# Altium project STM32_Calculator.PrjPcb
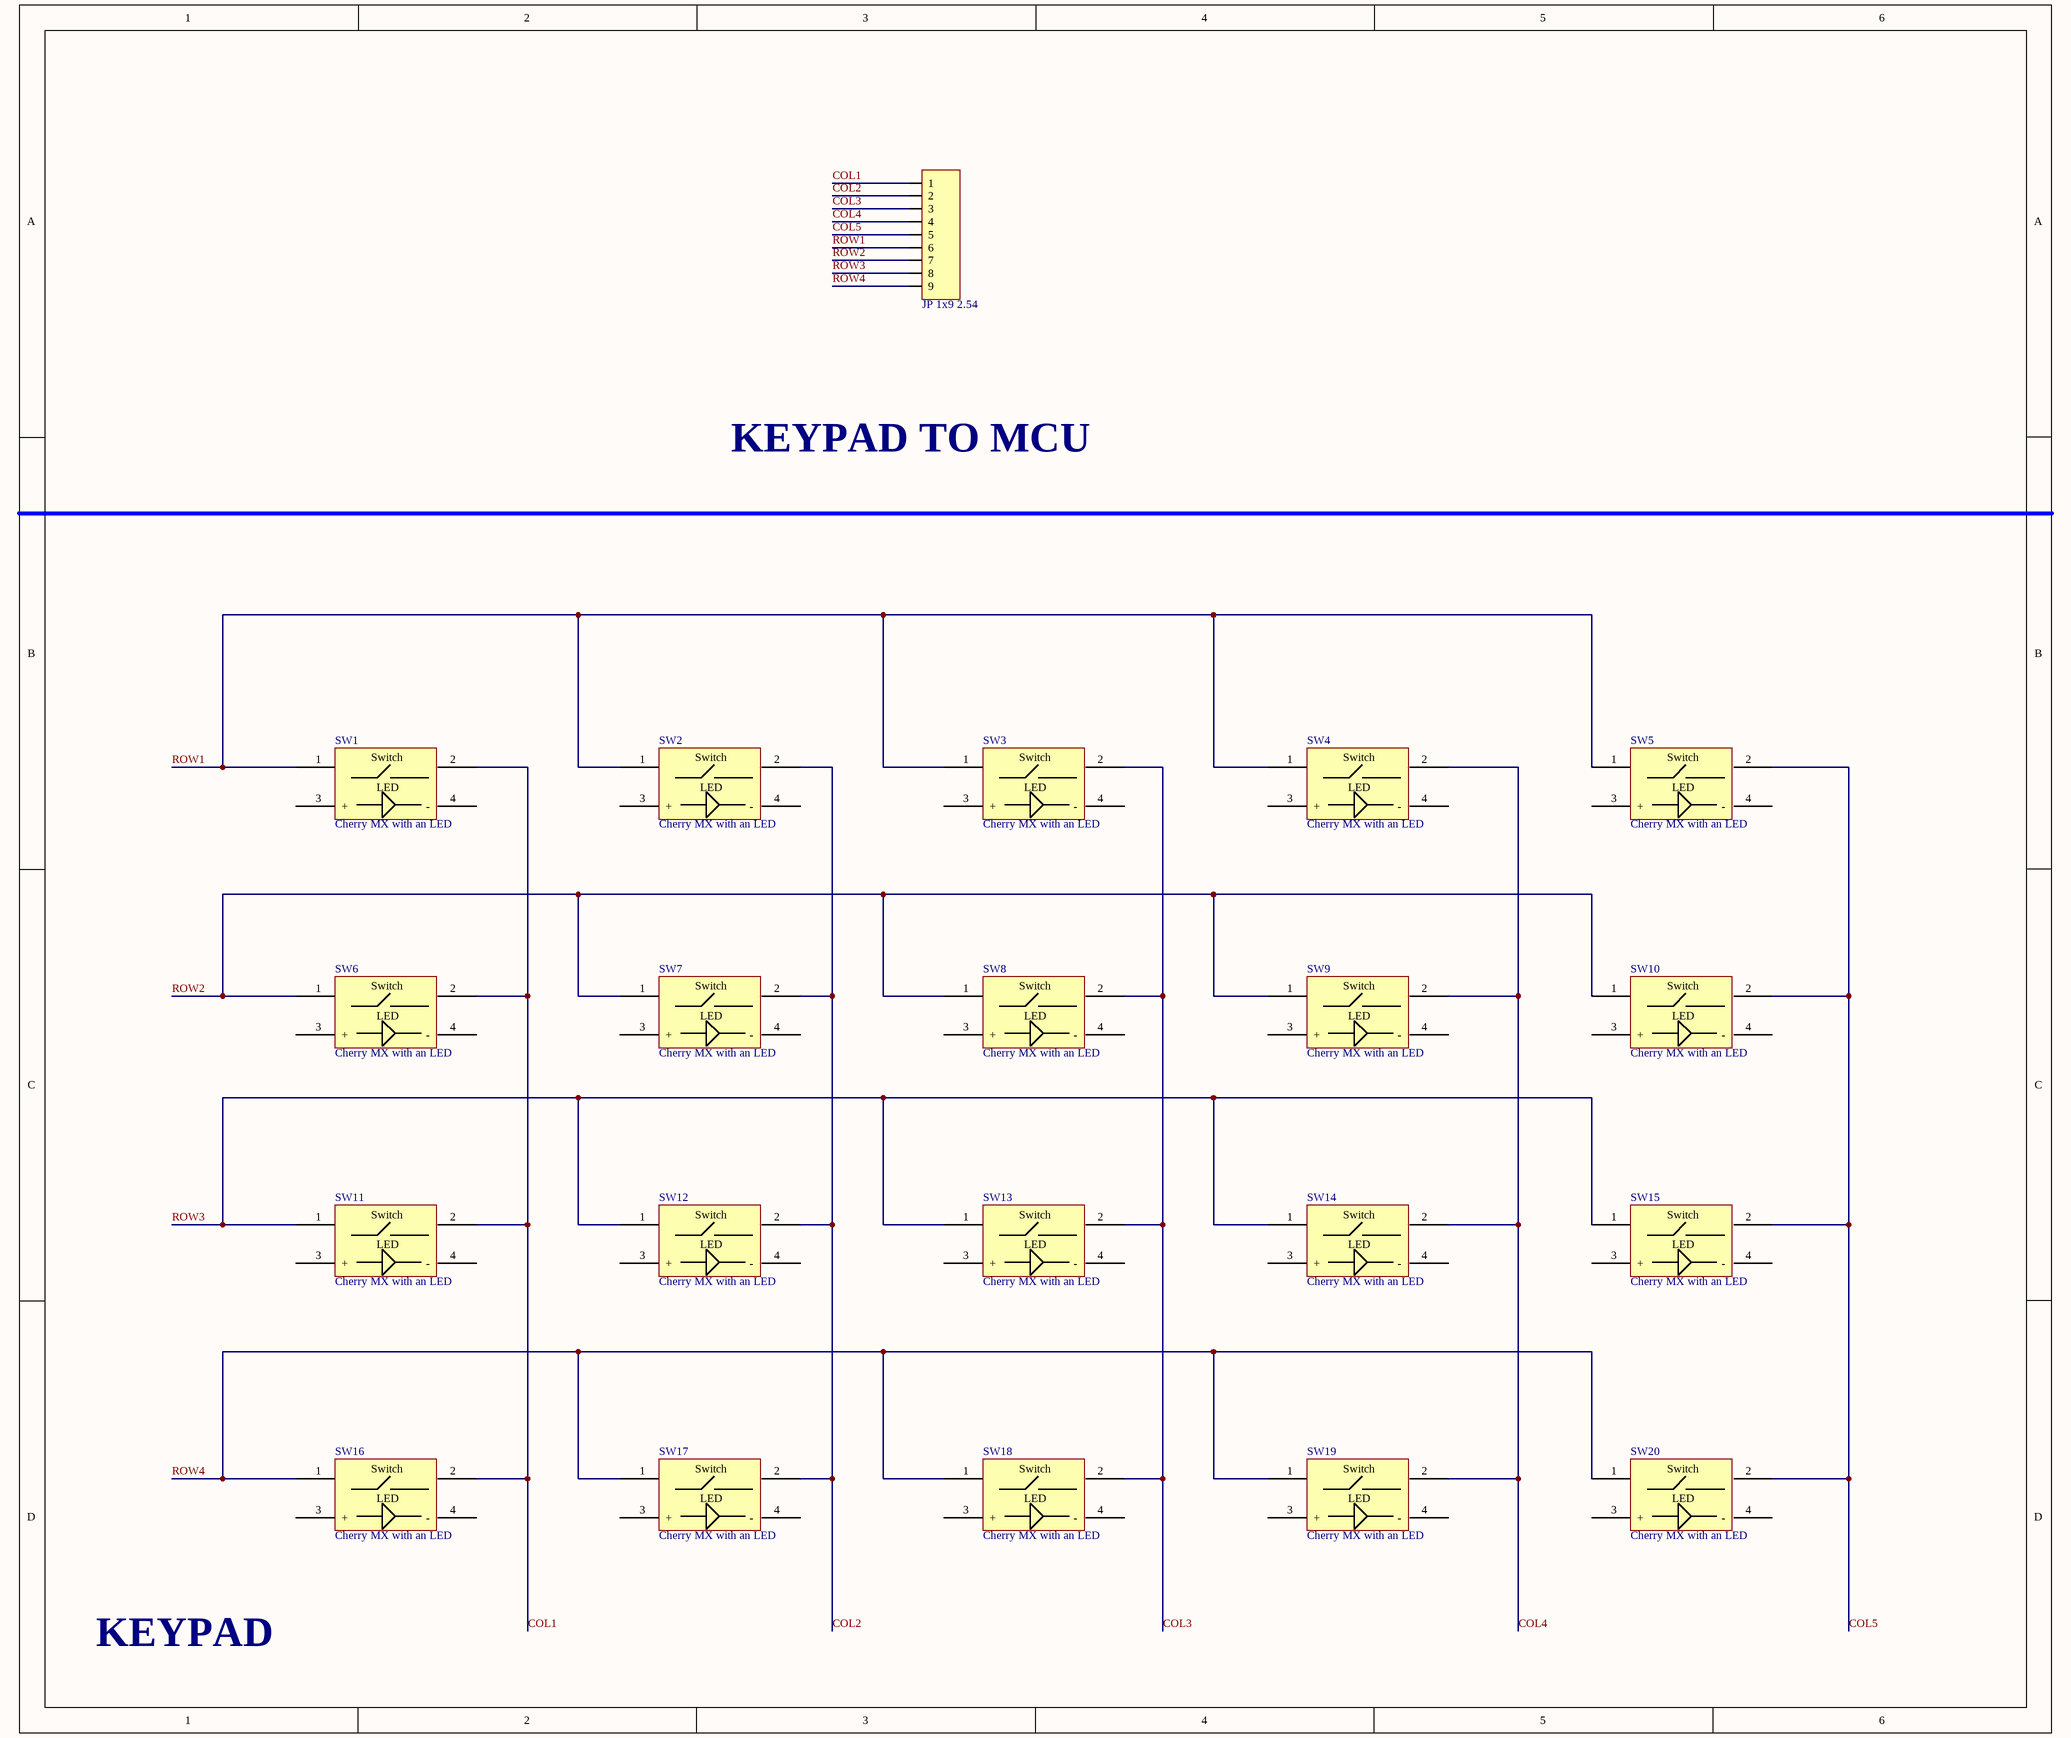
[diagram p0: SCHEMATIC.SchDoc]
1 sheet, 21 parts. Net scope: global (net labels, ports and power ports of the same name join across sheets).
Board files: calculator_pcb.PcbDoc, print_file_Keypad_LCD.PcbDoc

## Sheet SCHEMATIC.SchDoc
size 400 x 340 mm; SheetNumber: 1; SheetTotal: 1

### Parts
JP1  JP 1x9 2.54  [JP 1x9 DC]
SW1  Cherry MX with an LED  [MX_Cherry_LED]
SW2  Cherry MX with an LED  [MX_Cherry_LED]
SW3  Cherry MX with an LED  [MX_Cherry_LED]
SW4  Cherry MX with an LED  [MX_Cherry_LED]
SW5  Cherry MX with an LED  [MX_Cherry_LED]
SW6  Cherry MX with an LED  [MX_Cherry_LED]
SW7  Cherry MX with an LED  [MX_Cherry_LED]
SW8  Cherry MX with an LED  [MX_Cherry_LED]
SW9  Cherry MX with an LED  [MX_Cherry_LED]
SW10  Cherry MX with an LED  [MX_Cherry_LED]
SW11  Cherry MX with an LED  [MX_Cherry_LED]
SW12  Cherry MX with an LED  [MX_Cherry_LED]
SW13  Cherry MX with an LED  [MX_Cherry_LED]
SW14  Cherry MX with an LED  [MX_Cherry_LED]
SW15  Cherry MX with an LED  [MX_Cherry_LED]
SW16  Cherry MX with an LED  [MX_Cherry_LED]
SW17  Cherry MX with an LED  [MX_Cherry_LED]
SW18  Cherry MX with an LED  [MX_Cherry_LED]
SW19  Cherry MX with an LED  [MX_Cherry_LED]
SW20  Cherry MX with an LED  [MX_Cherry_LED]

### Nets
COL1: JP1.1 SW1.2 SW6.2 SW11.2 SW16.2
COL2: JP1.2 SW2.2 SW7.2 SW12.2 SW17.2
COL3: JP1.3 SW3.2 SW8.2 SW13.2 SW18.2
COL4: JP1.4 SW4.2 SW9.2 SW14.2 SW19.2
COL5: JP1.5 SW5.2 SW10.2 SW15.2 SW20.2
ROW1: JP1.6 SW1.1 SW2.1 SW3.1 SW4.1 SW5.1
ROW2: JP1.7 SW6.1 SW7.1 SW8.1 SW9.1 SW10.1
ROW3: JP1.8 SW11.1 SW12.1 SW13.1 SW14.1 SW15.1
ROW4: JP1.9 SW16.1 SW17.1 SW18.1 SW19.1 SW20.1

Not connected (* = marked no-connect by the designer): SW1 3(+) 4(-); SW2 3(+) 4(-); SW3 3(+) 4(-); SW4 3(+) 4(-); SW5 3(+) 4(-); SW6 3(+) 4(-); SW7 3(+) 4(-); SW8 3(+) 4(-); SW9 3(+) 4(-); SW10 3(+) 4(-); SW11 3(+) 4(-); SW12 3(+) 4(-); SW13 3(+) 4(-); SW14 3(+) 4(-); SW15 3(+) 4(-); SW16 3(+) 4(-); SW17 3(+) 4(-); SW18 3(+) 4(-); SW19 3(+) 4(-); SW20 3(+) 4(-)

### Notes on the sheet
- KEYPAD TO MCU
- KEYPAD
- (in symbol MX_Cherry_LED) Switch; LED

### Library data of the parts
JP1 = JP 1x9 2.54 Duc Cong: Cắm; Ten_Linh_Kien: Jump Đơn Đực 2.54MM 1x40P Cong Đứng; Don_Vi: Con; Ma_Hang: MH000904; Ghi_Chu: *; Kieu_Chan: *; Chung_Loai: Cắm
SW1-SW20 = MX_Cherry_LED